# EasyEDA schematic SCH_dddd_2025-12-29.json
TITLE: Sheet_1; REV: 1.0; Date: 2025-12-28; Sheet: 1/1; Drawn By: krishnsingh7777777; Company: Your Company
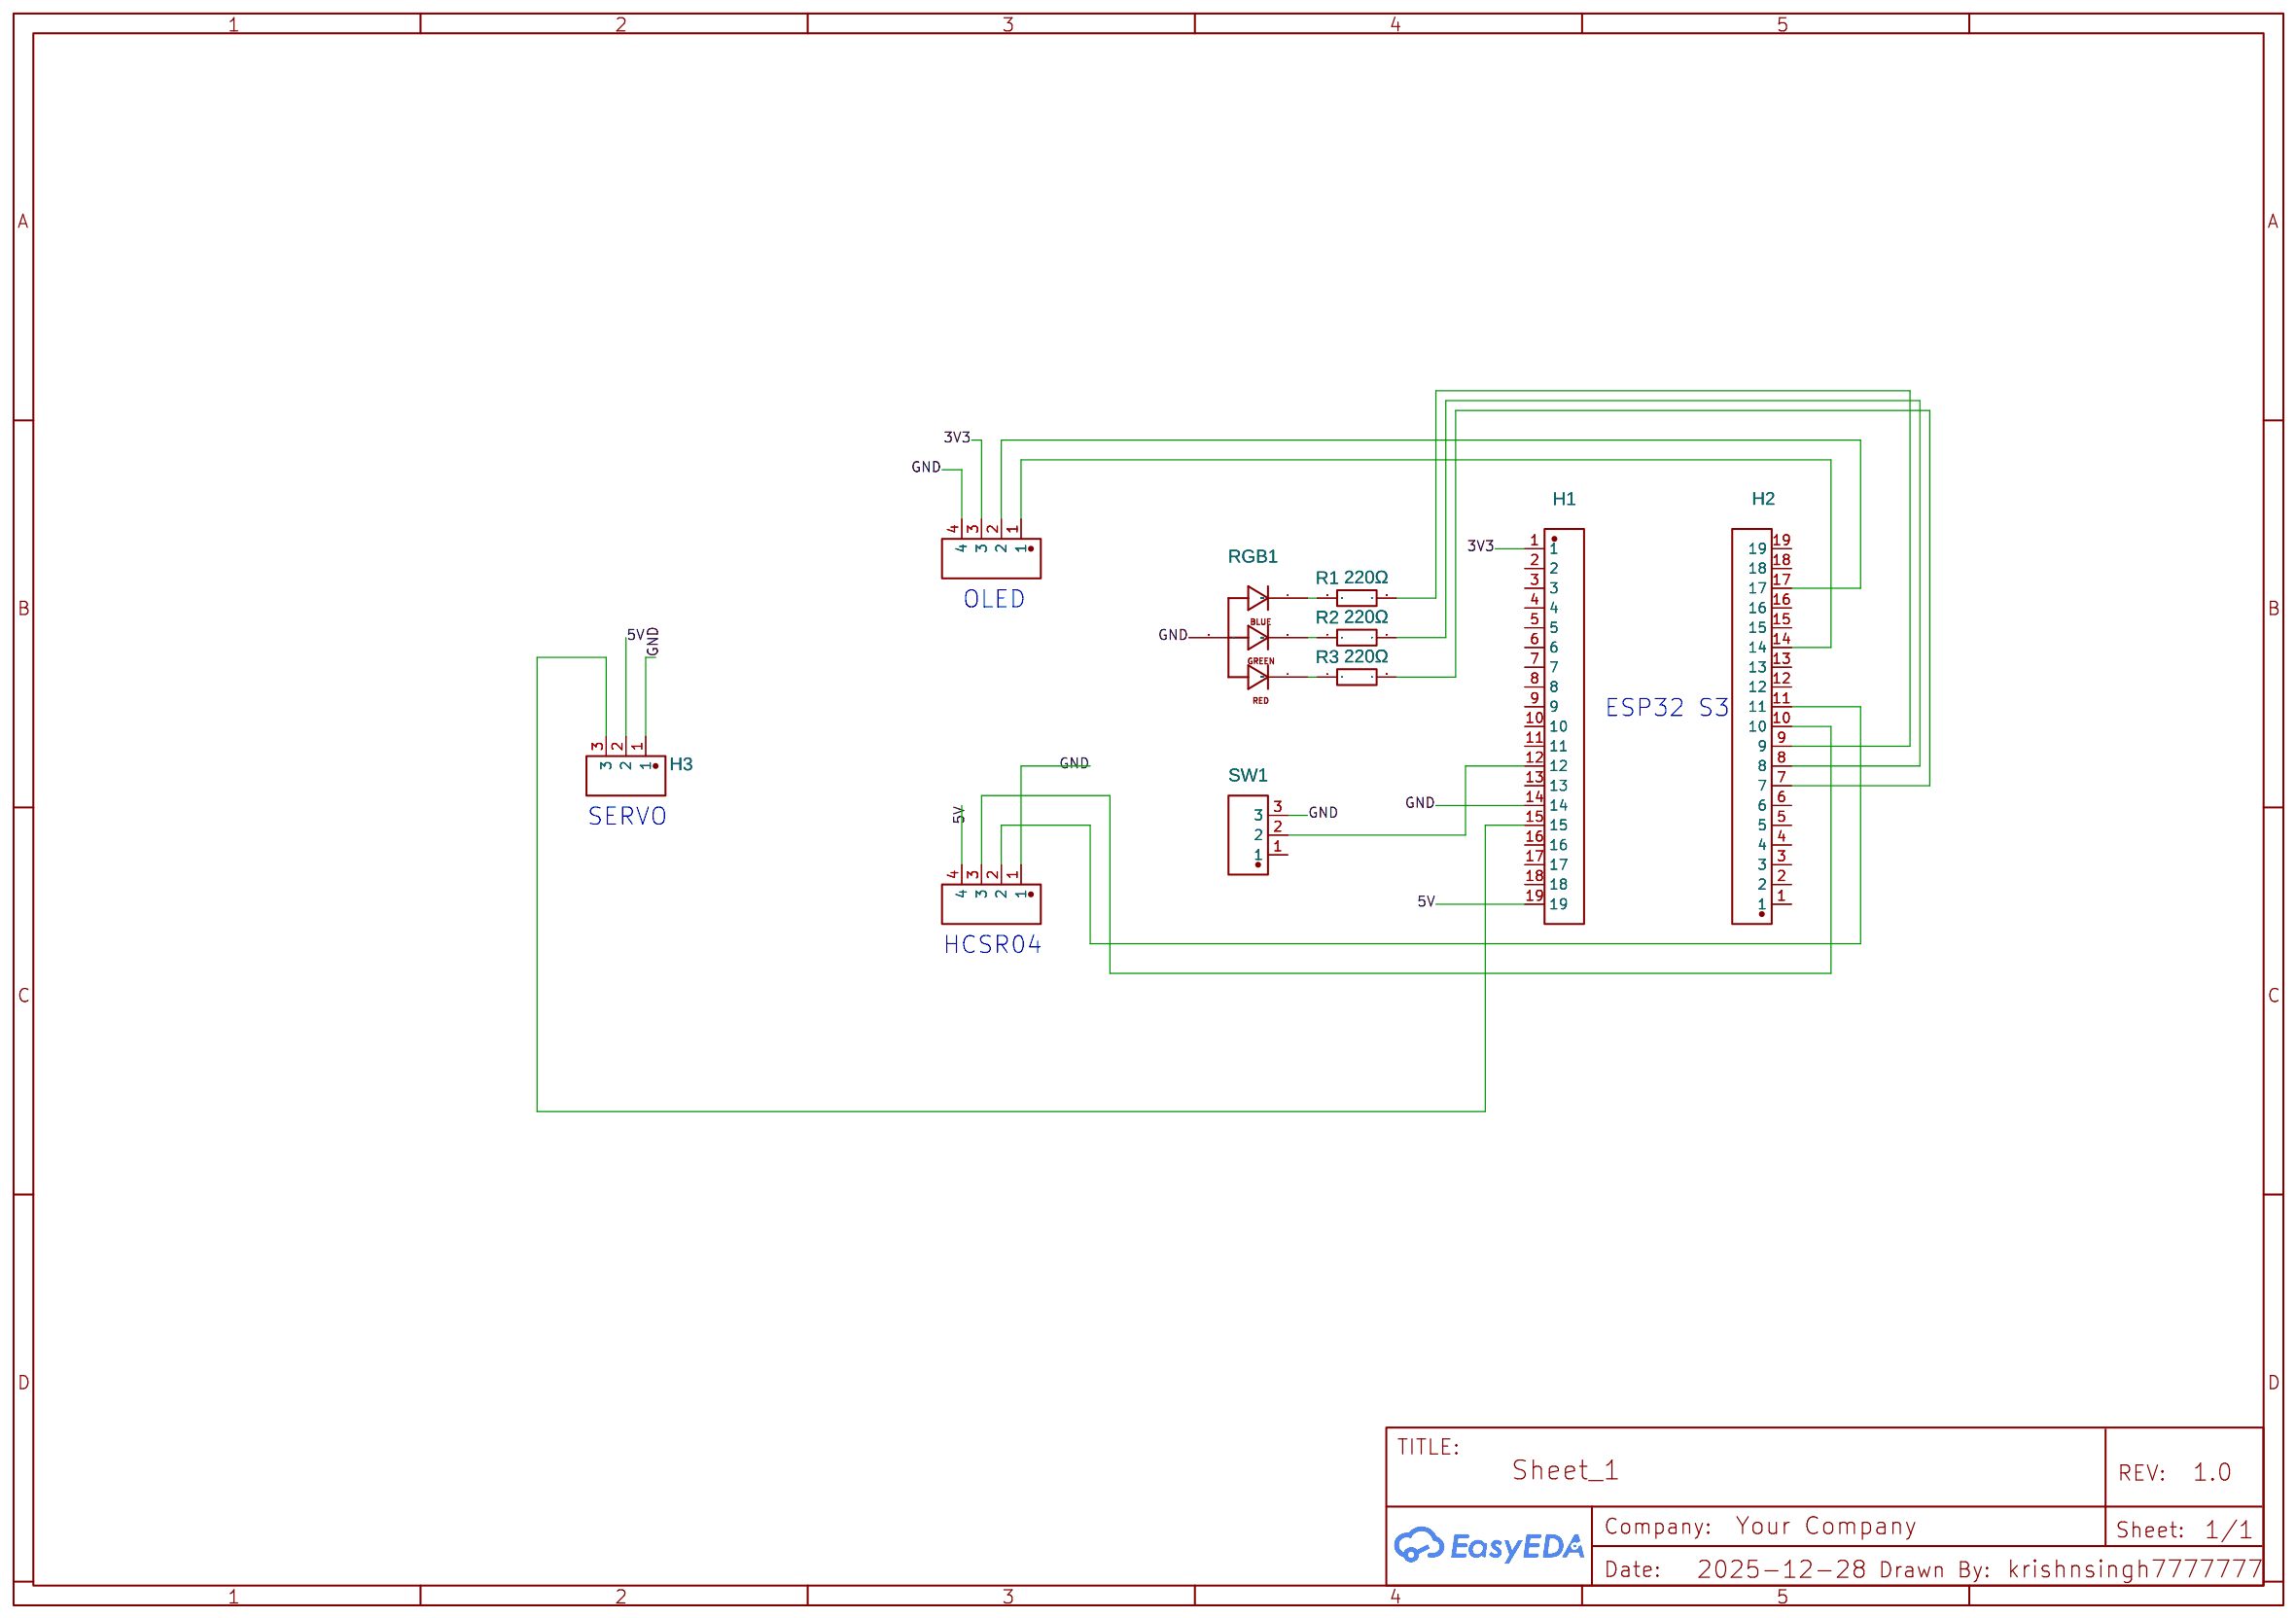
[diagram p0: schematic sheet]

## Parts
CN1  OLED  [CONN-TH_4P-L14.5-W4.7-P2.20]
CN2  HCSR04  [CONN-TH_4P-L14.5-W4.7-P2.20]
H1  KH-2.54PH180-1X19P-L11.5  [HDR-TH_19P-P2.54-V-M]
H2  KH-2.54PH180-1X19P-L11.5  [HDR-TH_19P-P2.54-V-M]
H3  SRVO  [HDR-TH_3P-P2.54-V-M-1]
R1  220Ω  [R0603]
R2  220Ω  [R0603]
R3  220Ω  [R0603]
RGB1  RGB  [LED-RGB-THRU]
SW1  SW1  [SW-TH_XKB_SS-12D10LXX]

## Library data of the parts
CN1 CN2 = STRAIGHT 4 PINS MAGNETIC CONNECTOR FEMALE: Supplier: LCSC; Supplier Part: C9900150561; Manufacturer: null; Manufacturer Part: Straight 4 pins magnetic connector Female; Contributor: lcsc
H1 H2 = KH-2.54PH180-1X19P-L11.5: Contributor: LCSC; Supplier: LCSC; Supplier Part: C2932706; Manufacturer: kinghelm(金航标); JLCPCB Part Class: Extended Part
H3 = HX PH254-01-03-Z-L11.5 PCB PIN HEADER: Supplier: LCSC; Supplier Part: C52016391; Manufacturer: hanxia(韩下); Manufacturer Part: HX PH254-01-03-Z-L11.5 pcb pin header; JLCPCB Part Class: Extended Part; Contributor: lcsc
R1-R3 = AC0603FR-07220RL: Supplier: LCSC; Manufacturer: YAGEO(国巨); Supplier Part: C138284; JLCPCB Part Class: Extended Part
RGB1 = LED-RGB-CA-THRUDIFFUSE: RGB Through-hole common anode; Contributor: SparkFun
SW1 = SS-12D10L10: Supplier: LCSC; Supplier Part: C5146663; Manufacturer: XKB Connection(中国星坤); JLCPCB Part Class: Extended Part; Contributor: lcsc

## Nets
3V3: CN1.3 H1.1
5V: CN2.4 H1.19 H3.2
GND: CN1.4 CN2.1 H1.14 H3.1 RGB1.2(ANODE) SW1.3
Net-(CN1-1): CN1.1 H2.14
Net-(CN1-2): CN1.2 H2.17
Net-(CN2-2): CN2.2 H2.11
Net-(CN2-3): CN2.3 H2.10
Net-(H1-12): H1.12 SW1.2
Net-(H1-15): H1.15 H3.3
Net-(H2-7): H2.7 R3.2
Net-(H2-8): H2.8 R2.2
Net-(H2-9): H2.9 R1.2
Net-(R1-1): R1.1 RGB1.4(BLUE_CATHODE)
Net-(R2-1): R2.1 RGB1.3(GREEN_CATHODE)
Net-(R3-1): R3.1 RGB1.1(RED_CATHODE)

Not connected (* = marked no-connect by the designer): H1 2 3 4 5 6 7 8 9 10 11 13 16 17 18; H2 1 2 3 4 5 6 12 13 15 16 18 19; SW1 1

## Notes on the sheet
- OLED
- ESP32 S3
- SERVO
- HCSR04
